# Altium project Pixhack_V5_CORE_V16.PrjPcb
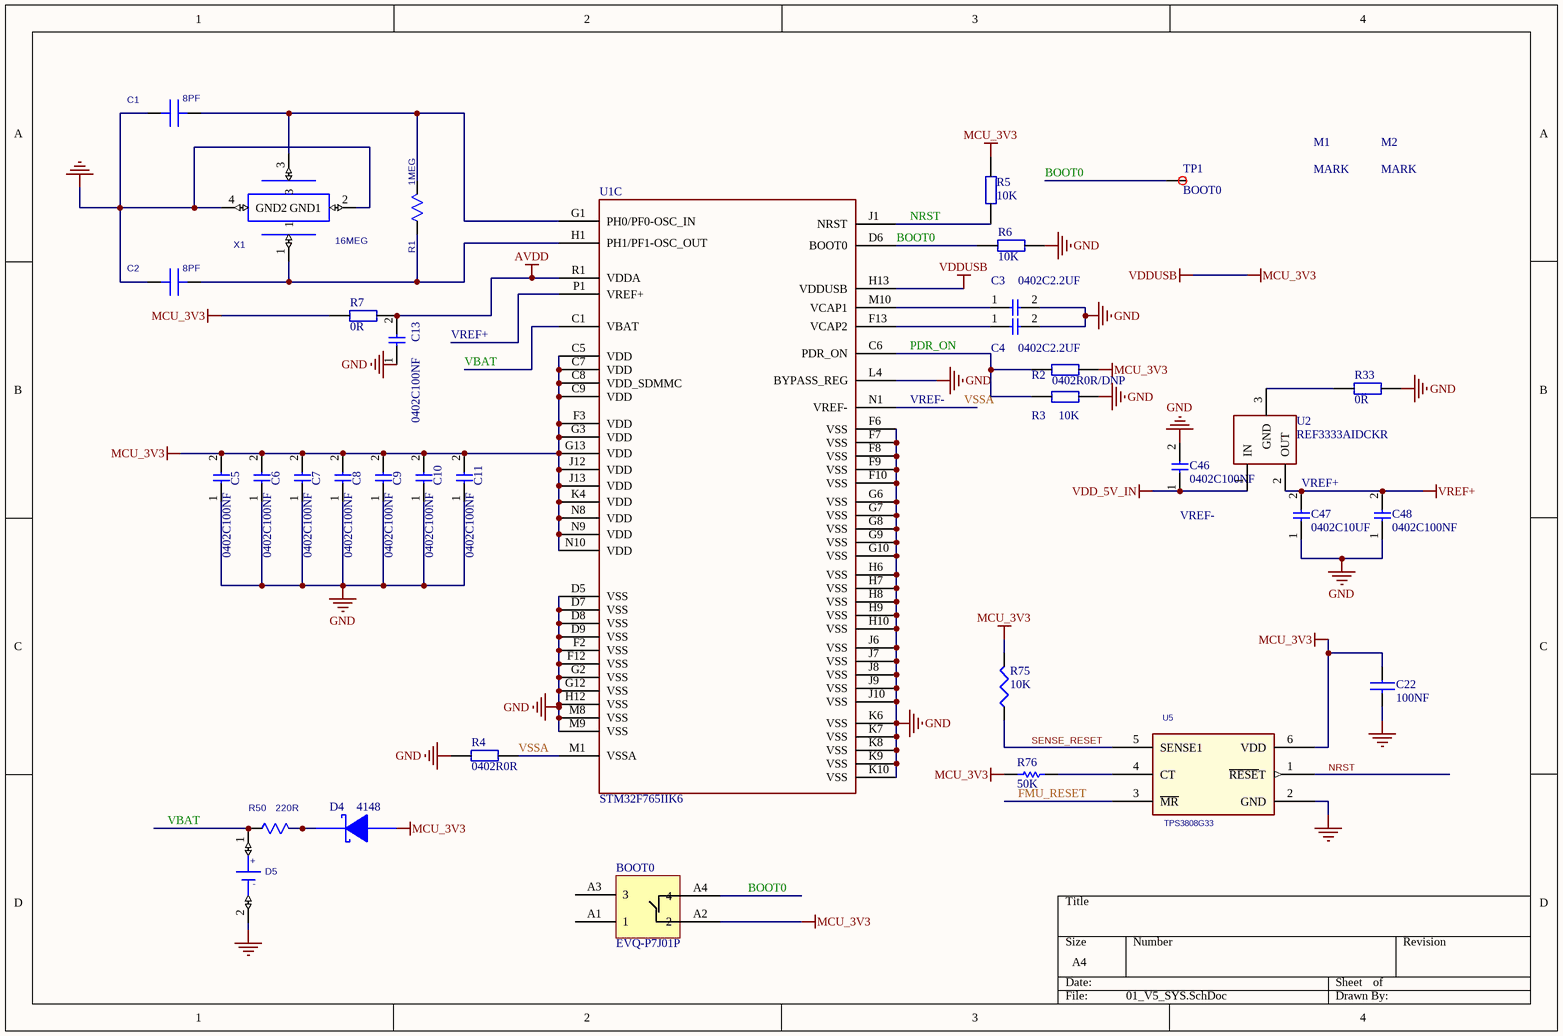
[diagram p0: 01_V5_SYS.SchDoc]
6 sheets, 100 parts. Net scope: global (net labels, ports and power ports of the same name join across sheets).
Board file: V5_CORE_V1.6.PcbDoc
Sheets:
  01_V5_SYS.SchDoc
  02_V5_IO1.SchDoc
  10_CAN_BUS.SchDoc
  IMU_CON.SchDoc
  11_5V_RAIL_ADC.SchDoc
  12_B_TO_B.SchDoc

## Sheet 01_V5_SYS.SchDoc
size A4

### Parts
BOOT0  EVQ-P7J01P  [EVQ-P7J01P]
C1  8PF  [SC0402]
C2  8PF  [SC0402]
C3  0402C2.2UF  [0402C]
C4  0402C2.2UF  [0402C]
C5  0402C100NF  [0402C]
C6  0402C100NF  [0402C]
C7  0402C100NF  [0402C]
C8  0402C100NF  [0402C]
C9  0402C100NF  [0402C]
C10  0402C100NF  [0402C]
C11  0402C100NF  [0402C]
C13  0402C100NF  [0402C]
C22  100NF  [0402cap]
C46  0402C100NF  [0402C]
C47  0402C10UF  [0402C]
C48  0402C100NF  [0402C]
D4  4148  [SOD323]
D5  PAS414HR-VE5R  [PAS414R-S-VE5R]  (value not drawn)
M1  MARK  [MARK]
M2  MARK  [MARK]
R1  1MEG  [SR0402]
R2  0402R0R/DNP  [0402R]
R3  10K  [0402R]
R4  0402R0R  [0402R]
R5  10K  [0402R]
R6  10K  [0402R]
R7  0R  [0402R]
R33  0R  [0402R]
R50  220R  [0402r]
R75  10K  [R0402]
R76  50K  [0402R]
TP1  BOOT0  [TP0.75]
U1  STM32F765IIK6  [UFBGA176]  (part C of 3)
U2  REF3333AIDCKR  [SC70]
U5  TPS3808G33  [SOT-23-6]
X1  16MEG  [3225]

### Nets
AVDD: C13.2 R7.1 U1.R1(VDDA)
GND: C1.1(A) C2.1(A) C3.2 C4.2 C5.1 C6.1 C7.1 C8.1 C9.1 C10.1 C11.1 C13.1 C22.2 C46.2 C47.1 C48.1 D5.2(-) R3.2 R4.1 R6.1 R33.1 U1.D5(VSS) U1.D7(VSS) U1.D8(VSS) U1.D9(VSS) U1.F2(VSS) U1.F6(VSS) U1.F7(VSS) U1.F8(VSS) U1.F9(VSS) U1.F10(VSS) U1.F12(VSS) U1.G2(VSS) U1.G6(VSS) U1.G7(VSS) U1.G8(VSS) U1.G9(VSS) U1.G10(VSS) U1.G12(VSS) U1.H6(VSS) U1.H7(VSS) U1.H8(VSS) U1.H9(VSS) U1.H10(VSS) U1.H12(VSS) U1.J6(VSS) U1.J7(VSS) U1.J8(VSS) U1.J9(VSS) U1.J10(VSS) U1.K6(VSS) U1.K7(VSS) U1.K8(VSS) U1.K9(VSS) U1.K10(VSS) U1.L4(BYPASS_REG) U1.M8(VSS) U1.M9(VSS) U5.2(GND) X1.2(GND1) X1.4(GND2)
MCU_3V3: BOOT0.A2(2) C5.2 C6.2 C7.2 C8.2 C9.2 C10.2 C11.2 C22.1 D4.A R2.2 R5.2 R7.2 R75.2 R76.2 U1.C5(VDD) U1.C7(VDD) U1.C8(VDD_SDMMC) U1.C9(VDD) U1.F3(VDD) U1.G3(VDD) U1.G13(VDD) U1.H13(VDDUSB) U1.J12(VDD) U1.J13(VDD) U1.K4(VDD) U1.N8(VDD) U1.N9(VDD) U1.N10(VDD) U5.6(VDD)  [also labelled VDDUSB]
VDD_5V_IN: C46.1 U2.1(IN)
VREF+: C47.2 C48.2 U1.P1(VREF+) U2.2(OUT)
BOOT0: BOOT0.A4(4) R6.2 TP1.0 U1.D6(BOOT0)
FMU_RESET: U5.3(~{MR})
NRST: R5.1 U1.J1(NRST) U5.1(~{RESE}T)
PDR_ON: R2.1 R3.1 U1.C6(PDR_ON)
SENSE_RESET: R75.1 U5.5(SENSE1)
VBAT: D5.1(+) R50.1(A) U1.C1(VBAT)
VREF-: R4.2 U1.M1(VSSA) U1.N1(VREF-)  [also labelled VSSA]
NetC1_2: C1.2(B) R1.2(B) U1.G1(PH0/PF0-OSC_IN) X1.3
NetC2_2: C2.2(B) R1.1(A) U1.H1(PH1/PF1-OSC_OUT) X1.1
NetC3_1: C3.1 U1.M10(VCAP1)
NetC4_1: C4.1 U1.F13(VCAP2)
NetD4_K: D4.K R50.2(B)
NetR33_2: R33.2 U2.3(GND)
NetR76_1: R76.1 U5.4(CT)

Not connected (* = marked no-connect by the designer): BOOT0 A1(1) A3(3)

### Notes on the sheet
- (near D5) +
- (near D5) -
- Labels drawn without touching a wire or pin: VREF-

### Library data of the parts
C1 C2 = C
C5-C11 C13 = 0402C100NF: 50V 5%
C22 = C1005X5R1H104K
C46-C48 = 0402C2.2UF
D4 = STPS20M100SG-TR: Manufacturer Name: STMicroelectronics; PackageReference: STPS20M100SG-TR; Manufacturer Part Number: STPS20M100SG-TR; Value: 4148
D5 = PWR1-2_1
R1 = R
R2-R7 R33 = 0402R0R: 0402R0R 1%
R50 = R: PARTS: 1; OriginalSymbolOrigin: (10,20); PINSWAP: (A,B); DEVICE: RK73H1ETTP1004F; PKG_TYPE: SR0402; LEVEL: STD; %208%%161%%192%%224%%195%%251%%179%%198%: 片式厚膜电阻器; COMPONENT_HIGH_MAX: 0.4MM; %215%%232%%214%%181%%212%%202%%208%%237%%198%%171%%178%%238%: +/-1%; %182%%238%%182%%168%%185%%166%%194%%202%(W): 0.06; %195%%232%%202%%246%: 片式厚膜电阻器-0.0625W-1000000OHM-+/-1%-0402; CODE: 7090857
R75 = RMCF0402FT4K99
R76 = Res Semi: Semiconductor Resistor
TP1 = TP_0.75: TP_0.75MM
U2 = REF3333AIDCKT
U5 = TPS3808G09DBVR: IC VOLT SUPERVISOR 0.9V SOT23-6; Part #: 102020-0009R; Manufacturer: Texas Instruments; .Checked PCB: used; Number of Voltages Monitored: 1; Output: Open Drain or Open Collector; Reset: Active Low; Reset Timeout: Adjustable/Selectable; Voltage - Threshold: 0.84V; .Checked SCH: used; Category: Integrated Circuits (ICs); Supplier Part Number: 296-17189-1-ND; Family: PMIC - Supervisors; Manufacturer Part Number: TPS3808G09DBVR; Operating Temperature: -40癈 ~ 125癈; Package / Case: SOT-23-6; Price 1k [$]: 1.12000; Value: TPS3808G09DBVR; Type: Simple Reset/Power-On Reset; Supplier: Digikey; Supplier 1: Digi-Key; Supplier Part Number 1: 296-17189-1-ND; RoHS: RoHS Compliant; Stock 1: 61681; Pricing 1: 1=2.45, 25=1.89, 100=1.715, 250=1.54, 500=1.33, 1000=1.12 (USD); Mounting Type: Surface Mount; Supplier Device Package: SOT-23-6; Packaging: Cut Tape (CT); ComponentLink1URL: http://www.ti.com/lit/ds/symlink/tps3808g01.pdf; ComponentLink1Description: http://www.ti.com/lit/ds/symlink/tps3808g01.pdf
X1 = X_B

## Sheet 02_V5_IO1.SchDoc
size A4
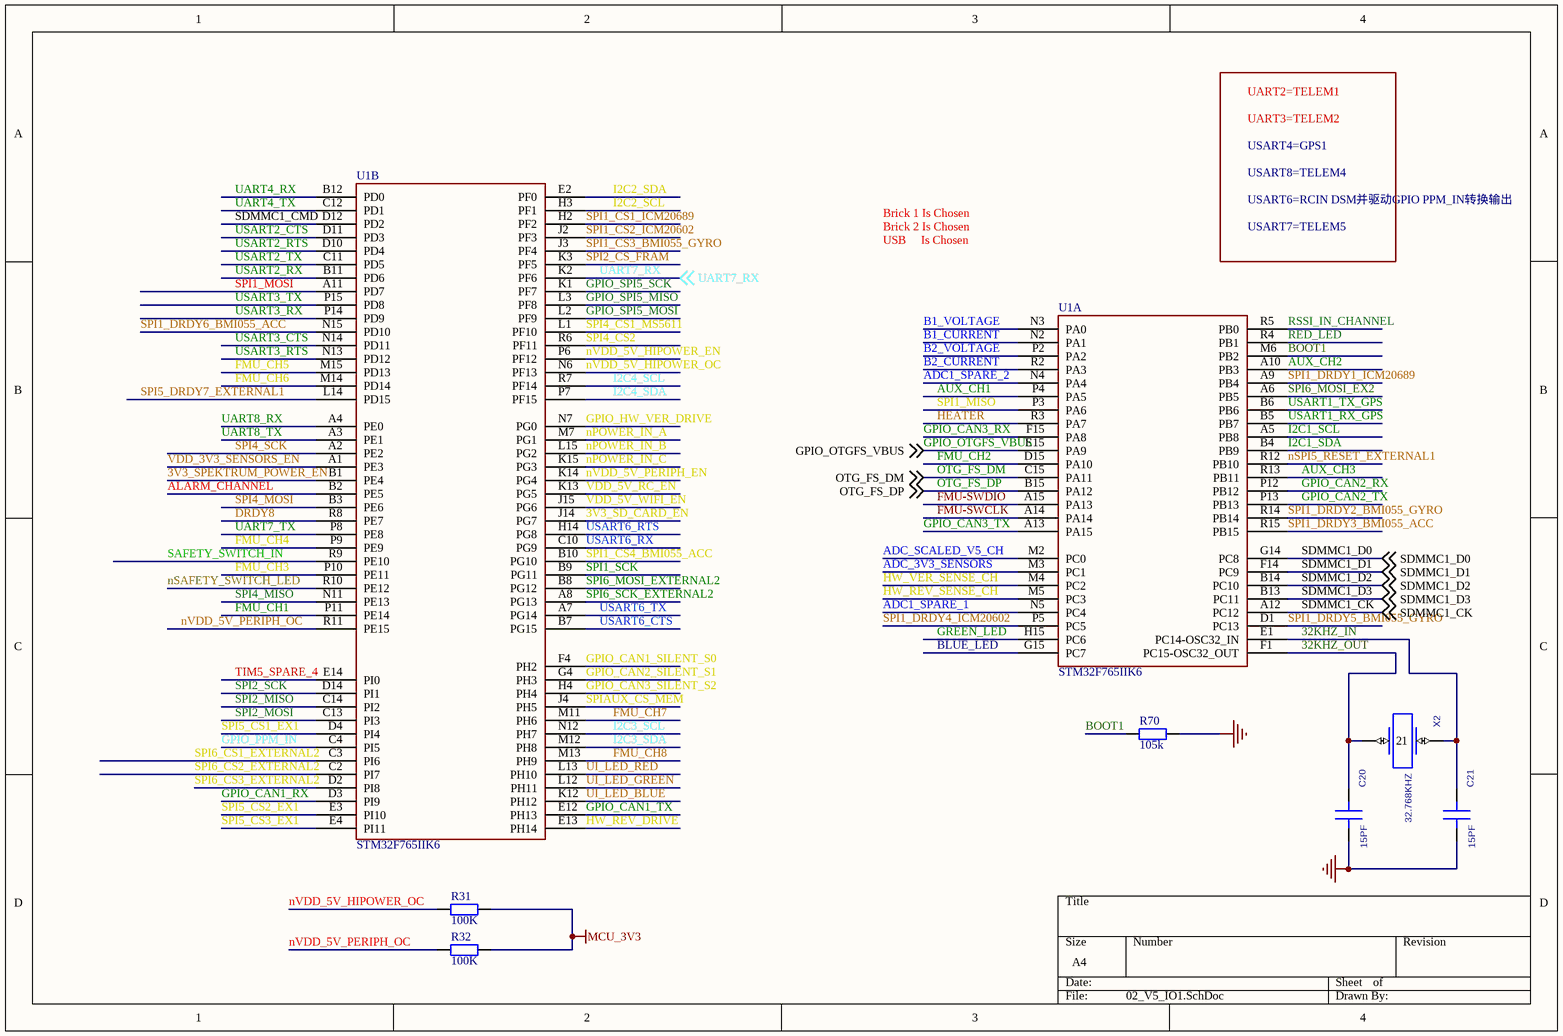
[diagram p1: 02_V5_IO1.SchDoc]

### Parts
C20  15PF  [SC0402]
C21  15PF  [SC0402]
R31  100K  [R0402]
R32  100K  [R0402]
R70  105k  [R0402]
U1  STM32F765IIK6  [UFBGA176]  (parts A,B of 3)
X2  32.768KHZ  [ABS06]

### Nets
GND: C20.2(B) C21.2(B) R70.2
GPIO_HW_VER_DRIVE: U1.N7(PG0)
HW_REV_DRIVE: U1.E13(PH14)
MCU_3V3: R31.2 R32.2
3V3_SD_CARD_EN: U1.J14(PG7)
3V3_SPEKTRUM_POWER_EN: U1.B1(PE4)
32KHZ_IN: C21.1(A) U1.E1(PC14-OSC32_IN) X2.1
32KHZ_OUT: C20.1(A) U1.F1(PC15-OSC32_OUT) X2.2
ADC1_SPARE_1: U1.N5(PC4)
ADC1_SPARE_2: U1.N4(PA4)
ADC_3V3_SENSORS: U1.M3(PC1)
ADC_SCALED_V5_CH: U1.M2(PC0)
ALARM_CHANNEL: U1.B2(PE5)
AUX_CH1: U1.P4(PA5)
AUX_CH2: U1.A10(PB3)
AUX_CH3: U1.R13(PB11)
B1_CURRENT: U1.N2(PA1)
B1_VOLTAGE: U1.N3(PA0)
B2_CURRENT: U1.R2(PA3)  [project net AUX_BATT_CURRENT_SENS]
B2_VOLTAGE: U1.P2(PA2)  [project net AUX_BATT_VOLTAGE_SENS]
BLUE_LED: U1.G15(PC7)
BOOT1: R70.1 U1.M6(PB2)
DRDY8: U1.R8(PE7)
FMU-SWCLK: U1.A14(PA14)
FMU-SWDIO: U1.A15(PA13)
FMU_CH1: U1.P11(PE14)
FMU_CH2: U1.D15(PA10)
FMU_CH3: U1.P10(PE11)
FMU_CH4: U1.P9(PE9)
FMU_CH5: U1.M15(PD13)
FMU_CH6: U1.M14(PD14)
FMU_CH7: U1.M11(PH6)
FMU_CH8: U1.M13(PH9)
GPIO_CAN1_RX: U1.D3(PI9)
GPIO_CAN1_SILENT_S0: U1.F4(PH2)
GPIO_CAN1_TX: U1.E12(PH13)
GPIO_CAN2_RX: U1.P12(PB12)
GPIO_CAN2_SILENT_S1: U1.G4(PH3)
GPIO_CAN2_TX: U1.P13(PB13)
GPIO_CAN3_RX: U1.F15(PA8)
GPIO_CAN3_SILENT_S2: U1.H4(PH4)
GPIO_CAN3_TX: U1.A13(PA15)
GPIO_OTGFS_VBUS: U1.E15(PA9) ; off-sheet GPIO_OTGFS_VBUS
GPIO_PPM_IN: U1.C4(PI5)
GPIO_SPI5_MISO: U1.L3(PF8)
GPIO_SPI5_MOSI: U1.L2(PF9)
GPIO_SPI5_SCK: U1.K1(PF7)
GREEN_LED: U1.H15(PC6)
HEATER: U1.R3(PA7)
HW_REV_SENSE_CH: U1.M5(PC3)
HW_VER_SENSE_CH: U1.M4(PC2)
I2C1_SCL: U1.A5(PB8)
I2C1_SDA: U1.B4(PB9)
I2C2_SCL: U1.H3(PF1)
I2C2_SDA: U1.E2(PF0)
I2C3_SCL: U1.N12(PH7)
I2C3_SDA: U1.M12(PH8)
I2C4_SCL: U1.R7(PF14)
I2C4_SDA: U1.P7(PF15)
nPOWER_IN_A: U1.M7(PG1)
nPOWER_IN_B: U1.L15(PG2)
nPOWER_IN_C: U1.K15(PG3)
nSAFETY_SWITCH_LED: U1.R10(PE12)
nSPI5_RESET_EXTERNAL1: U1.R12(PB10)
nVDD_5V_HIPOWER_EN: U1.P6(PF12)
nVDD_5V_HIPOWER_OC: R31.1 U1.N6(PF13)
nVDD_5V_PERIPH_EN: U1.K14(PG4)
nVDD_5V_PERIPH_OC: R32.1 U1.R11(PE15)
OTG_FS_DM: U1.C15(PA11) ; off-sheet OTG_FS_DM
OTG_FS_DP: U1.B15(PA12) ; off-sheet OTG_FS_DP
RED_LED: U1.R4(PB1)
RSSI_IN_CHANNEL: U1.R5(PB0)
SAFETY_SWITCH_IN: U1.R9(PE10)
SDMMC1_CK: U1.A12(PC12) ; off-sheet SDMMC1_CK
SDMMC1_CMD: U1.D12(PD2)
SDMMC1_D0: U1.G14(PC8) ; off-sheet SDMMC1_D0
SDMMC1_D1: U1.F14(PC9) ; off-sheet SDMMC1_D1
SDMMC1_D2: U1.B14(PC10) ; off-sheet SDMMC1_D2
SDMMC1_D3: U1.B13(PC11) ; off-sheet SDMMC1_D3
SPI1_CS1_ICM20689: U1.H2(PF2)
SPI1_CS2_ICM20602: U1.J2(PF3)
SPI1_CS3_BMI055_GYRO: U1.J3(PF4)
SPI1_CS4_BMI055_ACC: U1.B10(PG10)
SPI1_DRDY1_ICM20689: U1.A9(PB4)
SPI1_DRDY2_BMI055_GYRO: U1.R14(PB14)
SPI1_DRDY3_BMI055_ACC: U1.R15(PB15)
SPI1_DRDY4_ICM20602: U1.P5(PC5)
SPI1_DRDY5_BMI055_GYRO: U1.D1(PC13)
SPI1_DRDY6_BMI055_ACC: U1.N15(PD10)
SPI1_MISO: U1.P3(PA6)
SPI1_MOSI: U1.A11(PD7)
SPI1_SCK: U1.B9(PG11)
SPI2_CS_FRAM: U1.K3(PF5)
SPI2_MISO: U1.C14(PI2)
SPI2_MOSI: U1.C13(PI3)
SPI2_SCK: U1.D14(PI1)
SPI4_CS1_MS5611: U1.L1(PF10)
SPI4_CS2: U1.R6(PF11)
SPI4_MISO: U1.N11(PE13)
SPI4_MOSI: U1.B3(PE6)
SPI4_SCK: U1.A2(PE2)
SPI5_CS1_EX1: U1.D4(PI4)
SPI5_CS2_EX1: U1.E3(PI10)
SPI5_CS3_EX1: U1.E4(PI11)
SPI5_DRDY7_EXTERNAL1: U1.L14(PD15)
SPI6_CS1_EXTERNAL2: U1.C3(PI6)
SPI6_CS2_EXTERNAL2: U1.C2(PI7)
SPI6_CS3_EXTERNAL2: U1.D2(PI8)
SPI6_MOSI_EX2: U1.A6(PB5)
SPI6_MOSI_EXTERNAL2: U1.B8(PG12)
SPI6_SCK_EXTERNAL2: U1.A8(PG13)
SPIAUX_CS_MEM: U1.J4(PH5)
TIM5_SPARE_4: U1.E14(PI0)
UART4_RX: U1.B12(PD0)
UART4_TX: U1.C12(PD1)
UART7_RX: U1.K2(PF6) ; off-sheet UART7_RX
UART7_TX: U1.P8(PE8)
UART8_RX: U1.A4(PE0)
UART8_TX: U1.A3(PE1)
UI_LED_BLUE: U1.K12(PH12)
UI_LED_GREEN: U1.L12(PH11)
UI_LED_RED: U1.L13(PH10)
USART1_RX_GPS: U1.B5(PB7)
USART1_TX_GPS: U1.B6(PB6)
USART2_CTS: U1.D11(PD3)
USART2_RTS: U1.D10(PD4)
USART2_RX: U1.B11(PD6)
USART2_TX: U1.C11(PD5)
USART3_CTS: U1.N14(PD11)
USART3_RTS: U1.N13(PD12)
USART3_RX: U1.P14(PD9)
USART3_TX: U1.P15(PD8)
USART6_CTS: U1.B7(PG15)
USART6_RTS: U1.H14(PG8)
USART6_RX: U1.C10(PG9)
USART6_TX: U1.A7(PG14)
VDD_3V3_SENSORS_EN: U1.A1(PE3)
VDD_5V_RC_EN: U1.K13(PG5)
VDD_5V_WIFI_EN: U1.J15(PG6)

### Notes on the sheet
- Labels drawn without touching a wire or pin: Brick 1 Is Chosen, Brick 2 Is Chosen, UART2=TELEM1, UART3=TELEM2, USART4=GPS1, USART6=RCIN DSM并驱动GPIO PPM_IN转换输出, USART7=TELEM5, USART8=TELEM4, USB     Is Chosen

### Library data of the parts
C20 = C: PARTS: 1; OriginalSymbolOrigin: (0,30); DEVICE: C0402C150J5GAC_7867; LEVEL: STD; PINSWAP: (A,B); %208%%161%%192%%224%%195%%251%%179%%198%: SMD陶瓷电容; COMPONENT_HIGH_MAX: 0.55MM; %182%%238%%182%%168%%185%%164%%215%%247%%181%%231%%209%%185%(V): 50; %195%%232%%202%%246%: SMD陶瓷电容-50V-0.015NF-+/-5%-NP0-0402; CODE: 8070544; PKG_TYPE: SC0402
C21 = C: PARTS: 1; OriginalSymbolOrigin: (0,30); DEVICE: C0402C150J5GAC_7867; LEVEL: STD; PINSWAP: (A,B); CODE: 8070544; %195%%232%%202%%246%: SMD陶瓷电容-50V-0.015NF-+/-5%-NP0-0402; %182%%238%%182%%168%%185%%164%%215%%247%%181%%231%%209%%185%(V): 50; COMPONENT_HIGH_MAX: 0.55MM; %208%%161%%192%%224%%195%%251%%179%%198%: SMD陶瓷电容; PKG_TYPE: SC0402
R31 R32 R70 = Res2: Resistor; Value: 1K; Published: 8-Jun-2000; LatestRevisionDate: 17-Jul-2002; LatestRevisionNote: Re-released for DXP Platform.; PackageReference: AXIAL-0.4; Publisher: Altium Limited; PackageDescription: Axial Device, Thru-Hole; 2 Leads; 0.4 in Pin Spacing
X2 = X_0: PARTS: 1; OriginalSymbolOrigin: (10,40); LEVEL: STD; PKG_TYPE: HSX2-0302; DEVICE: 9H03200019; CODE: 12020212; %208%%161%%192%%224%%195%%251%%179%%198%: 晶体谐振器; COMPONENT_HIGH_MAX: 0.85MM; %195%%232%%202%%246%: 晶体谐振器-0.032768MHZ-12.5PF-+/-20PPM-70000OHM-SMD3.2*1.5

## Sheet 10_CAN_BUS.SchDoc
size A4
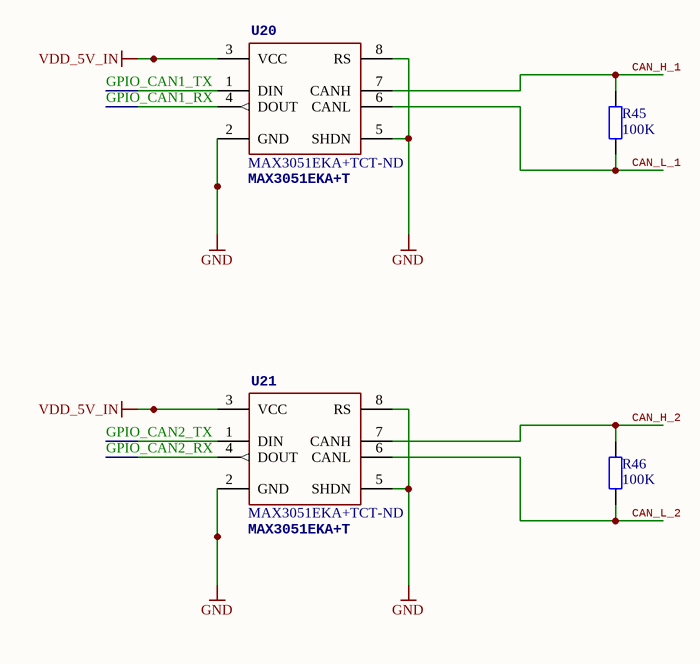
[diagram p2: 10_CAN_BUS.SchDoc]

### Parts
R45  100K  [R0402]
R46  100K  [R0402]
U20  MAX3051EKA+T  Supplier Part Number 1: MAX3051EKA+TCT-ND  [SOT23-8]
U21  MAX3051EKA+T  Supplier Part Number 1: MAX3051EKA+TCT-ND  [SOT23-8]

### Nets
GND: U20.2(GND) U20.5(SHDN) U20.8(RS) U21.2(GND) U21.5(SHDN) U21.8(RS)
VDD_5V_IN: U20.3(VCC) U21.3(VCC)
CAN_H_1: R45.1 U20.7(CANH)
CAN_H_2: R46.1 U21.7(CANH)
CAN_L_1: R45.2 U20.6(CANL)
CAN_L_2: R46.2 U21.6(CANL)
GPIO_CAN1_RX: U20.4(DOUT)
GPIO_CAN1_TX: U20.1(DIN)
GPIO_CAN2_RX: U21.4(DOUT)
GPIO_CAN2_TX: U21.1(DIN)

### Library data of the parts
R45 R46 = Res2: Resistor; Value: 1K; Published: 8-Jun-2000; LatestRevisionDate: 17-Jul-2002; LatestRevisionNote: Re-released for DXP Platform.; PackageReference: AXIAL-0.4; Publisher: Altium Limited; PackageDescription: Axial Device, Thru-Hole; 2 Leads; 0.4 in Pin Spacing
U20 U21 = MAX3051MAX3051EKA: IC TXRX CAN 1MBPS SOT23-8; 3DR_PARTNO: ECM0831; Supplier 1: Digi-Key; PARTNO: MAX3051EKA+T; Value: CAN

## Sheet IMU_CON.SchDoc
size A4
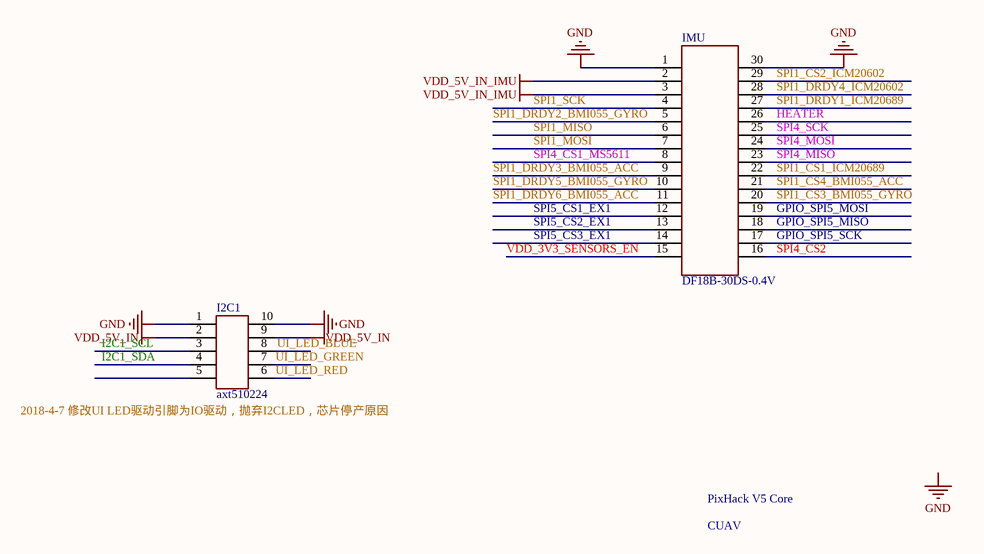
[diagram p3: IMU_CON.SchDoc]

### Parts
I2C1  axt510224  [axt510224]
IMU  DF18B-30DS-0.4V  [DF18B-30DS-0.4V]
PixHack_V5_Core  CUAV  [CUAV]

### Nets
GND: I2C1.1 I2C1.10 IMU.1 IMU.30
VDD_5V_IN: I2C1.2 I2C1.9
VDD_5V_IN_IMU: IMU.2 IMU.3
GPIO_SPI5_MISO: IMU.18
GPIO_SPI5_MOSI: IMU.19
GPIO_SPI5_SCK: IMU.17
HEATER: IMU.26
I2C1_SCL: I2C1.3
I2C1_SDA: I2C1.4
SPI1_CS1_ICM20689: IMU.22
SPI1_CS2_ICM20602: IMU.29
SPI1_CS3_BMI055_GYRO: IMU.20
SPI1_CS4_BMI055_ACC: IMU.21
SPI1_DRDY1_ICM20689: IMU.27
SPI1_DRDY2_BMI055_GYRO: IMU.5
SPI1_DRDY3_BMI055_ACC: IMU.9
SPI1_DRDY4_ICM20602: IMU.28
SPI1_DRDY5_BMI055_GYRO: IMU.10
SPI1_DRDY6_BMI055_ACC: IMU.11
SPI1_MISO: IMU.6
SPI1_MOSI: IMU.7
SPI1_SCK: IMU.4
SPI4_CS1_MS5611: IMU.8
SPI4_CS2: IMU.16
SPI4_MISO: IMU.23
SPI4_MOSI: IMU.24
SPI4_SCK: IMU.25
SPI5_CS1_EX1: IMU.12
SPI5_CS2_EX1: IMU.13
SPI5_CS3_EX1: IMU.14
UI_LED_BLUE: I2C1.8
UI_LED_GREEN: I2C1.7
UI_LED_RED: I2C1.6
VDD_3V3_SENSORS_EN: IMU.15

Not connected (* = marked no-connect by the designer): I2C1 5

### Notes on the sheet
- Labels drawn without touching a wire or pin: 2018-4-7 修改UI LED驱动引脚为IO驱动，抛弃I2CLED，芯片停产原因, GND

## Sheet 11_5V_RAIL_ADC.SchDoc
size A4
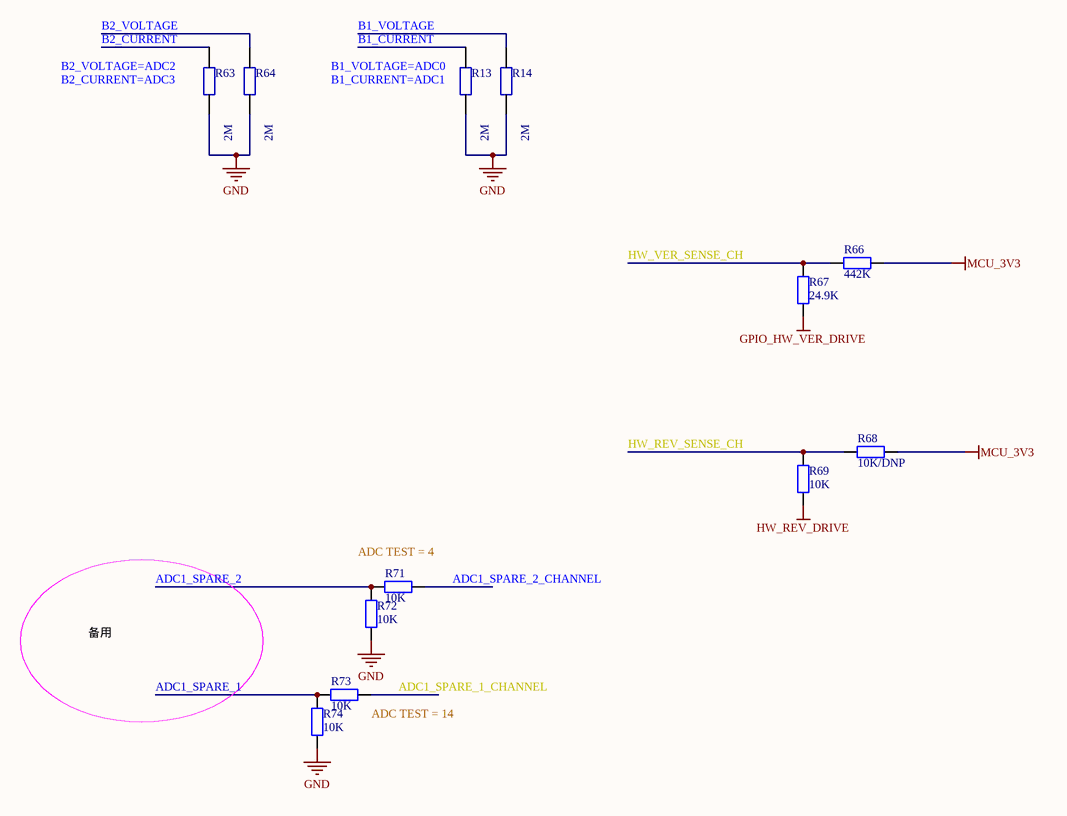
[diagram p4: 11_5V_RAIL_ADC.SchDoc]

### Parts
R13  2M  [0402R]
R14  2M  [0402R]
R63  2M  [0402R]
R64  2M  [0402R]
R66  442K  [R0402]
R67  24.9K  [R0402]
R68  10K/DNP  [R0402]
R69  10K  [R0402]
R71  10K  [R0402]
R72  10K  [R0402]
R73  10K  [R0402]
R74  10K  [R0402]

### Nets
GND: R13.2 R14.2 R63.2 R64.2 R72.1 R74.1
GPIO_HW_VER_DRIVE: R67.1
HW_REV_DRIVE: R69.1
MCU_3V3: R66.2 R68.2
ADC1_SPARE_1: R73.1 R74.2
ADC1_SPARE_1_CHANNEL: R73.2
ADC1_SPARE_2: R71.1 R72.2
ADC1_SPARE_2_CHANNEL: R71.2
B1_CURRENT: R13.1
B1_VOLTAGE: R14.1
B2_CURRENT: R63.1  [project net AUX_BATT_CURRENT_SENS]
B2_VOLTAGE: R64.1  [project net AUX_BATT_VOLTAGE_SENS]
HW_REV_SENSE_CH: R68.1 R69.2
HW_VER_SENSE_CH: R66.1 R67.2

### Notes on the sheet
- Labels drawn without touching a wire or pin: ADC TEST = 4, ADC TEST = 14, B1_CURRENT=ADC1, B1_VOLTAGE=ADC0, B2_CURRENT=ADC3, B2_VOLTAGE=ADC2, 备用

### Library data of the parts
R13 R14 R63 R64 = 0402R10K: 0402R10K 1%
R66-R69 R71-R74 = Res2: Resistor; Value: 1K; Published: 8-Jun-2000; LatestRevisionDate: 17-Jul-2002; LatestRevisionNote: Re-released for DXP Platform.; PackageReference: AXIAL-0.4; Publisher: Altium Limited; PackageDescription: Axial Device, Thru-Hole; 2 Leads; 0.4 in Pin Spacing

## Sheet 12_B_TO_B.SchDoc
size A3
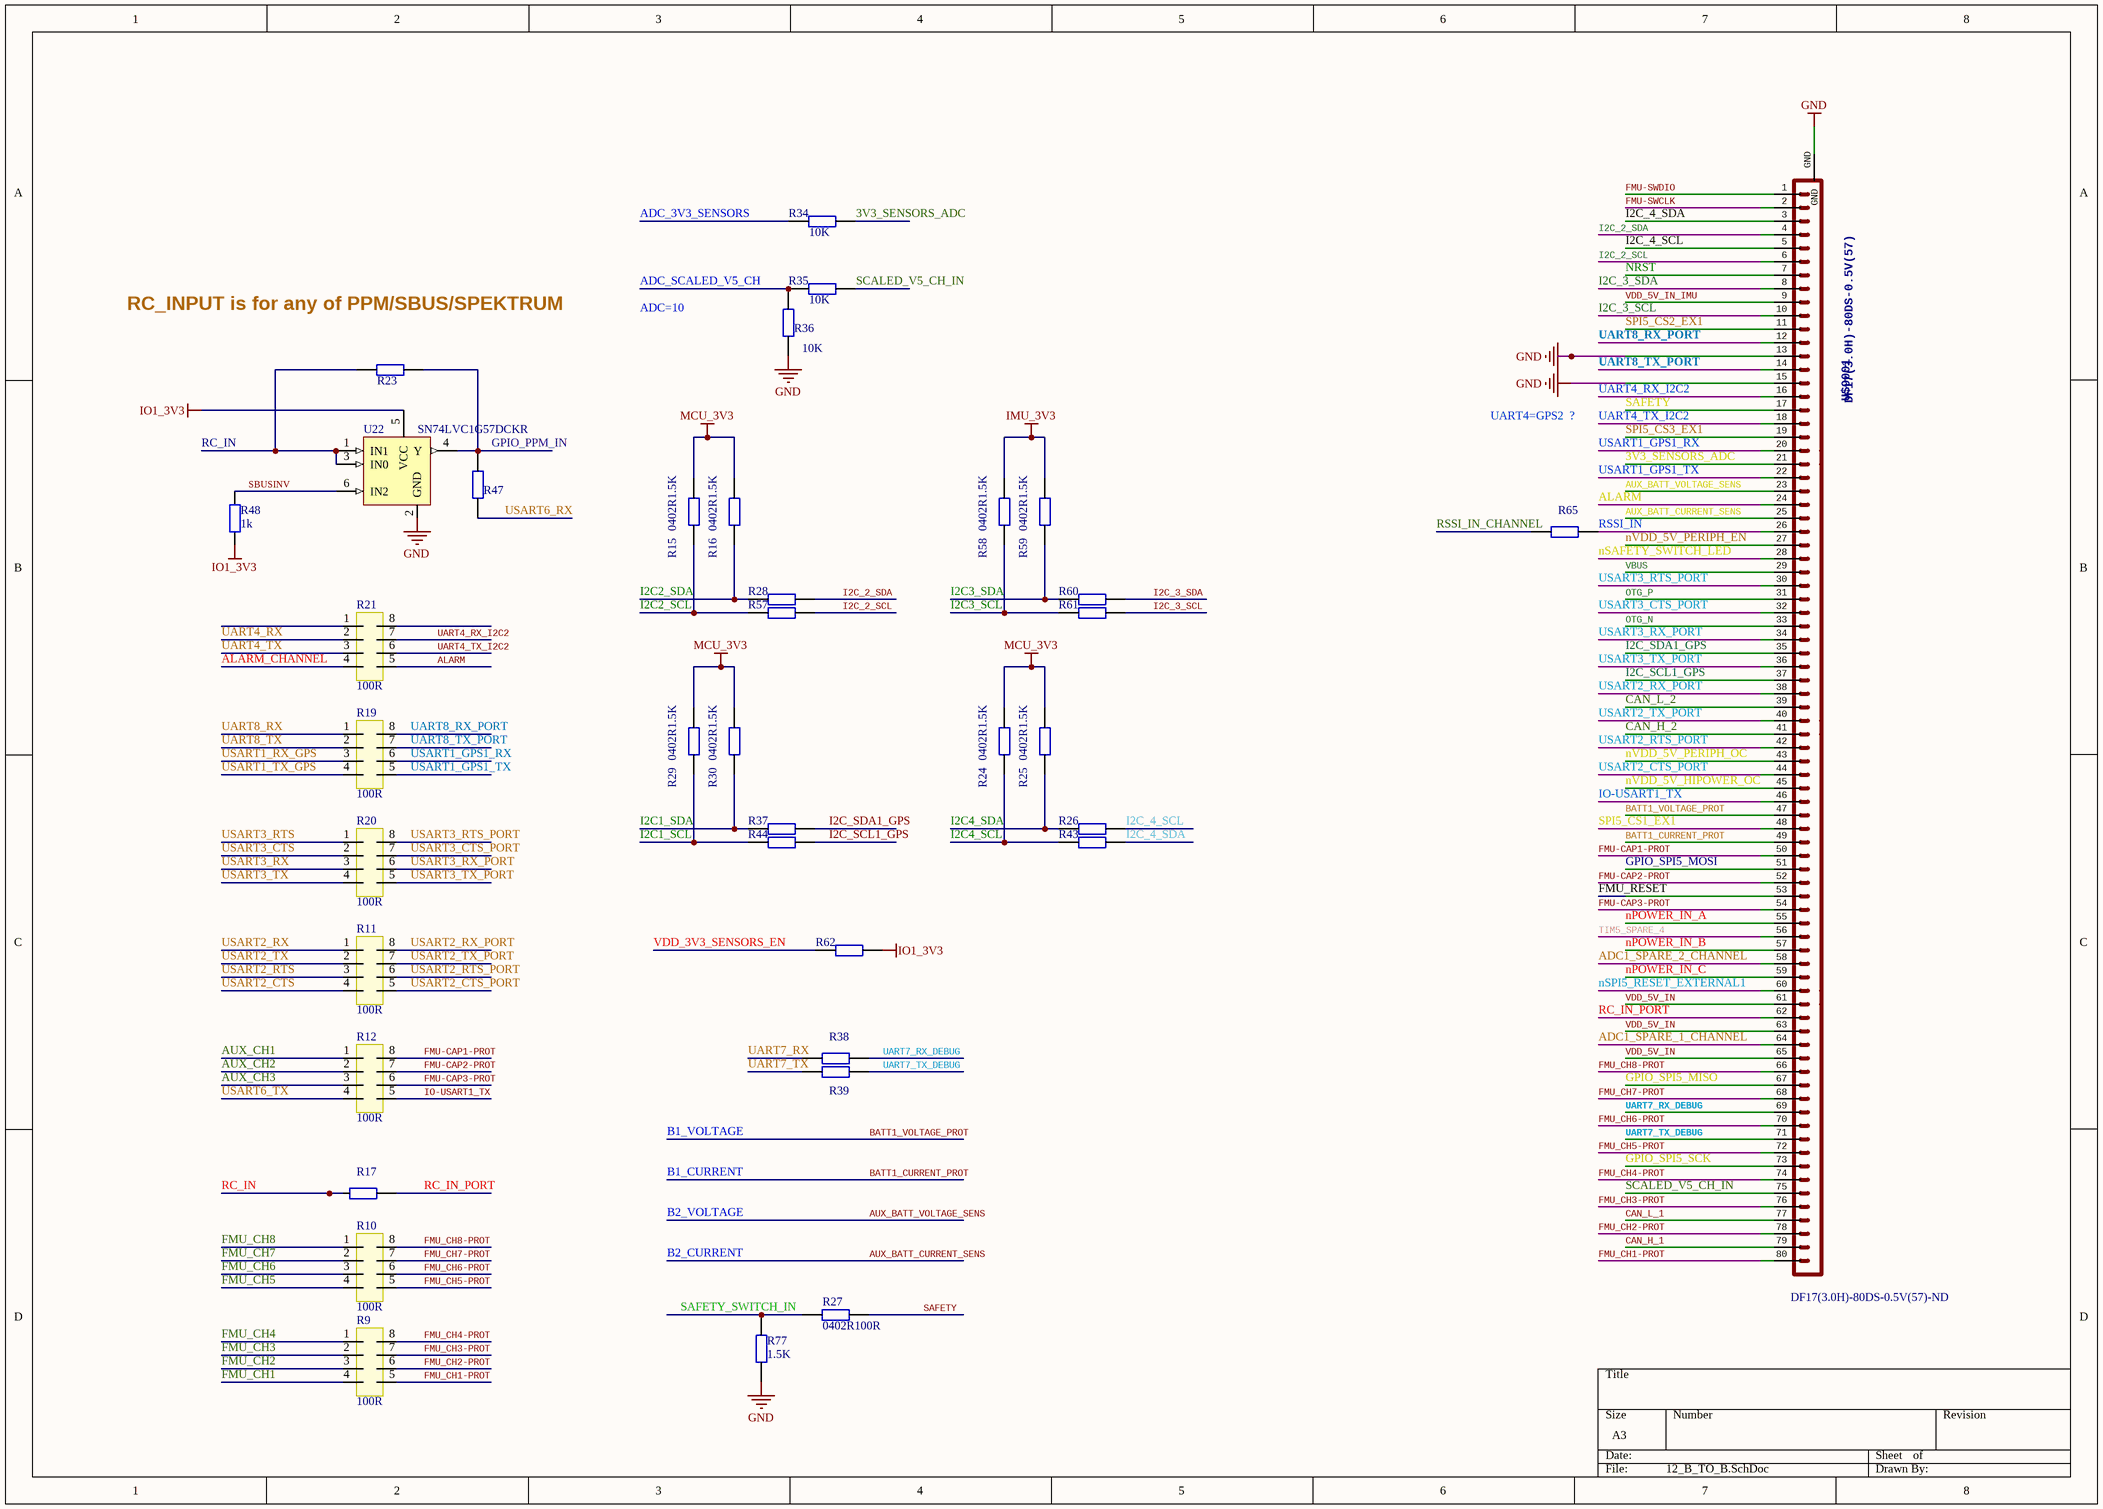
[diagram p5: 12_B_TO_B.SchDoc]

### Parts
R9  100R  [0402_4r]
R10  100R  [0402_4r]
R11  100R  [0402_4r]
R12  100R  [0402_4r]
R15  0402R1.5K  [0402R]
R16  0402R1.5K  [0402R]
R17  0402R100R  [0402R]  (value not drawn)
R19  100R  [0402_4r]
R20  100R  [0402_4r]
R21  100R  [0402_4r]
R23  100R/NC  [0402R]  (value not drawn)
R24  0402R1.5K  [0402R]
R25  0402R1.5K  [0402R]
R26  0402R100R  [0402R]  (value not drawn)
R27  0402R100R  [0402R]
R28  0402R100R  [0402R]  (value not drawn)
R29  0402R1.5K  [0402R]
R30  0402R1.5K  [0402R]
R34  10K  [0402R]
R35  10K  [0402R]
R36  10K  [0402R]
R37  0402R100R  [0402R]  (value not drawn)
R38  0402R100R  [0402R]  (value not drawn)
R39  0402R100R  [0402R]  (value not drawn)
R43  0402R100R  [0402R]  (value not drawn)
R44  0402R100R  [0402R]  (value not drawn)
R47  100R  [0402R]  (value not drawn)
R48  1k  [R0402]
R57  0402R100R  [0402R]  (value not drawn)
R58  0402R1.5K  [0402R]
R59  0402R1.5K  [0402R]
R60  0402R100R  [0402R]  (value not drawn)
R61  0402R100R  [0402R]  (value not drawn)
R62  10K/NC  [0402R]  (value not drawn)
R65  0402R100R  [0402R]  (value not drawn)
R77  1.5K  [0402R]
U22  SN74LVC1G57DCKR  [sot323-6]
U$9001  DF17(3.0H)-80DS-0.5V(57)  Supplier Part Number 1: DF17(3.0H)-80DS-0.5V(57)-ND  [DF17(3.0H)-80DS-0.5V(57)]

### Nets
GND: R36.1 R77.1 U22.2(GND) U$9001.13 U$9001.15 U$9001.GND
IMU_3V3: R58.2 R59.2
IO1_3V3: R48.1 R62.2 U22.5(VCC)
MCU_3V3: R15.2 R16.2 R24.2 R25.2 R29.2 R30.2
VDD_5V_IN: U$9001.61 U$9001.63 U$9001.65
VDD_5V_IN_IMU: U$9001.9
3V3_SENSORS_ADC: R34.2 U$9001.21
ADC1_SPARE_1_CHANNEL: U$9001.64
ADC1_SPARE_2_CHANNEL: U$9001.58
ADC_3V3_SENSORS: R34.1
ADC_SCALED_V5_CH: R35.1 R36.2
ALARM: R21.5 U$9001.24
ALARM_CHANNEL: R21.4
AUX_BATT_CURRENT_SENS: U$9001.25  [also labelled B2_CURRENT]
AUX_BATT_VOLTAGE_SENS: U$9001.23  [also labelled B2_VOLTAGE]
AUX_CH1: R12.1
AUX_CH2: R12.2
AUX_CH3: R12.3
B1_CURRENT: U$9001.49  [also labelled BATT1_CURRENT_PROT]
B1_VOLTAGE: U$9001.47  [also labelled BATT1_VOLTAGE_PROT]
CAN_H_1: U$9001.79
CAN_H_2: U$9001.41
CAN_L_1: U$9001.77
CAN_L_2: U$9001.39
FMU-CAP1-PROT: R12.8 U$9001.50
FMU-CAP2-PROT: R12.7 U$9001.52
FMU-CAP3-PROT: R12.6 U$9001.54
FMU-SWCLK: U$9001.2
FMU-SWDIO: U$9001.1
FMU_CH1: R9.4
FMU_CH1-PROT: R9.5 U$9001.80
FMU_CH2: R9.3
FMU_CH2-PROT: R9.6 U$9001.78
FMU_CH3: R9.2
FMU_CH3-PROT: R9.7 U$9001.76
FMU_CH4: R9.1
FMU_CH4-PROT: R9.8 U$9001.74
FMU_CH5: R10.4
FMU_CH5-PROT: R10.5 U$9001.72
FMU_CH6: R10.3
FMU_CH6-PROT: R10.6 U$9001.70
FMU_CH7: R10.2
FMU_CH7-PROT: R10.7 U$9001.68
FMU_CH8: R10.1
FMU_CH8-PROT: R10.8 U$9001.66
FMU_RESET: U$9001.53
GPIO_PPM_IN: R23.1 R47.2 U22.4(Y)
GPIO_SPI5_MISO: U$9001.67
GPIO_SPI5_MOSI: U$9001.51
GPIO_SPI5_SCK: U$9001.73
I2C1_SCL: R29.1 R44.1
I2C1_SDA: R30.1 R37.1
I2C2_SCL: R15.1 R57.1
I2C2_SDA: R16.1 R28.1
I2C3_SCL: R58.1 R61.1
I2C3_SDA: R59.1 R60.1
I2C4_SCL: R24.1 R43.1
I2C4_SDA: R25.1 R26.1
I2C_2_SCL: R57.2 U$9001.6
I2C_2_SDA: R28.2 U$9001.4
I2C_3_SCL: R61.2 U$9001.10
I2C_3_SDA: R60.2 U$9001.8
I2C_4_SCL: R26.2 U$9001.5
I2C_4_SDA: R43.2 U$9001.3
I2C_SCL1_GPS: R44.2 U$9001.37
I2C_SDA1_GPS: R37.2 U$9001.35
IO-USART1_TX: R12.5 U$9001.46
nPOWER_IN_A: U$9001.55
nPOWER_IN_B: U$9001.57
nPOWER_IN_C: U$9001.59
NRST: U$9001.7
nSAFETY_SWITCH_LED: U$9001.28
nSPI5_RESET_EXTERNAL1: U$9001.60
nVDD_5V_HIPOWER_OC: U$9001.45
nVDD_5V_PERIPH_EN: U$9001.27
nVDD_5V_PERIPH_OC: U$9001.43
OTG_N: U$9001.33
OTG_P: U$9001.31
RC_IN: R17.1 R23.2 U22.1(IN1) U22.3(IN0)
RC_IN_PORT: R17.2 U$9001.62
RSSI_IN: R65.2 U$9001.26
RSSI_IN_CHANNEL: R65.1
SAFETY: R27.2 U$9001.17
SAFETY_SWITCH_IN: R27.1 R77.2
SBUSINV: R48.2 U22.6(IN2)
SCALED_V5_CH_IN: R35.2 U$9001.75
SPI5_CS1_EX1: U$9001.48
SPI5_CS2_EX1: U$9001.11
SPI5_CS3_EX1: U$9001.19
TIM5_SPARE_4: U$9001.56
UART4_RX: R21.2
UART4_RX_I2C2: R21.7 U$9001.16
UART4_TX: R21.3
UART4_TX_I2C2: R21.6 U$9001.18
UART7_RX: R38.1
UART7_RX_DEBUG: R38.2 U$9001.69
UART7_TX: R39.1
UART7_TX_DEBUG: R39.2 U$9001.71
UART8_RX: R19.1
UART8_RX_PORT: R19.8 U$9001.12
UART8_TX: R19.2
UART8_TX_PORT: R19.7 U$9001.14
USART1_GPS1_RX: R19.6 U$9001.20
USART1_GPS1_TX: R19.5 U$9001.22
USART1_RX_GPS: R19.3
USART1_TX_GPS: R19.4
USART2_CTS: R11.4
USART2_CTS_PORT: R11.5 U$9001.44
USART2_RTS: R11.3
USART2_RTS_PORT: R11.6 U$9001.42
USART2_RX: R11.1
USART2_RX_PORT: R11.8 U$9001.38
USART2_TX: R11.2
USART2_TX_PORT: R11.7 U$9001.40
USART3_CTS: R20.2
USART3_CTS_PORT: R20.7 U$9001.32
USART3_RTS: R20.1
USART3_RTS_PORT: R20.8 U$9001.30
USART3_RX: R20.3
USART3_RX_PORT: R20.6 U$9001.34
USART3_TX: R20.4
USART3_TX_PORT: R20.5 U$9001.36
USART6_RX: R47.1
USART6_TX: R12.4
VBUS: U$9001.29
VDD_3V3_SENSORS_EN: R62.1

Not connected (* = marked no-connect by the designer): R21 1 8

### Notes on the sheet
- RC_INPUT is for any of PPM/SBUS/SPEKTRUM
- Labels drawn without touching a wire or pin: ADC=10, UART4=GPS2  ?

### Library data of the parts
R9-R12 R19-R21 = 0402-8R-4R
R15 R16 R24 R25 R29 R30 R58 R59 = 0402R10K: 0402R10K 1%
R17 R23 R26-R28 R34-R39 R43 R44 R47 R57 R60-R62 R65 R77 = 0402R100R: 0402R100R 1%
R48 = Res2: Resistor; Published: 8-Jun-2000; LatestRevisionDate: 17-Jul-2002; LatestRevisionNote: Re-released for DXP Platform.; PackageReference: AXIAL-0.4; Publisher: Altium Limited; PackageDescription: Axial Device, Thru-Hole; 2 Leads; 0.4 in Pin Spacing; Value: 1K
U22 = 74LVC1G57
U$9001 = CON-DF17-80F

## Nets that join several sheets
GND: 01_V5_SYS (61 pins), 02_V5_IO1 (C20.2 C21.2 R70.2), 10_CAN_BUS (6 pins), IMU_CON (I2C1.1 I2C1.10 IMU.1 IMU.30), 11_5V_RAIL_ADC (6 pins), 12_B_TO_B (6 pins)
GPIO_HW_VER_DRIVE: 02_V5_IO1 (U1.N7), 11_5V_RAIL_ADC (R67.1)
HW_REV_DRIVE: 02_V5_IO1 (U1.E13), 11_5V_RAIL_ADC (R69.1)
MCU_3V3: 01_V5_SYS (30 pins), 02_V5_IO1 (R31.2 R32.2), 11_5V_RAIL_ADC (R66.2 R68.2), 12_B_TO_B (6 pins)
VDD_5V_IN: 01_V5_SYS (C46.1 U2.1), 10_CAN_BUS (U20.3 U21.3), IMU_CON (I2C1.2 I2C1.9), 12_B_TO_B (U$9001.61 U$9001.63 U$9001.65)
VDD_5V_IN_IMU: IMU_CON (IMU.2 IMU.3), 12_B_TO_B (U$9001.9)
ADC1_SPARE_1: 02_V5_IO1 (U1.N5), 11_5V_RAIL_ADC (R73.1 R74.2)
ADC1_SPARE_1_CHANNEL: 11_5V_RAIL_ADC (R73.2), 12_B_TO_B (U$9001.64)
ADC1_SPARE_2: 02_V5_IO1 (U1.N4), 11_5V_RAIL_ADC (R71.1 R72.2)
ADC1_SPARE_2_CHANNEL: 11_5V_RAIL_ADC (R71.2), 12_B_TO_B (U$9001.58)
ADC_3V3_SENSORS: 02_V5_IO1 (U1.M3), 12_B_TO_B (R34.1)
ADC_SCALED_V5_CH: 02_V5_IO1 (U1.M2), 12_B_TO_B (R35.1 R36.2)
ALARM_CHANNEL: 02_V5_IO1 (U1.B2), 12_B_TO_B (R21.4)
AUX_BATT_CURRENT_SENS: 02_V5_IO1 (U1.R2), 11_5V_RAIL_ADC (R63.1), 12_B_TO_B (U$9001.25)
AUX_BATT_VOLTAGE_SENS: 02_V5_IO1 (U1.P2), 11_5V_RAIL_ADC (R64.1), 12_B_TO_B (U$9001.23)
AUX_CH1: 02_V5_IO1 (U1.P4), 12_B_TO_B (R12.1)
AUX_CH2: 02_V5_IO1 (U1.A10), 12_B_TO_B (R12.2)
AUX_CH3: 02_V5_IO1 (U1.R13), 12_B_TO_B (R12.3)
B1_CURRENT: 02_V5_IO1 (U1.N2), 11_5V_RAIL_ADC (R13.1), 12_B_TO_B (U$9001.49)
B1_VOLTAGE: 02_V5_IO1 (U1.N3), 11_5V_RAIL_ADC (R14.1), 12_B_TO_B (U$9001.47)
CAN_H_1: 10_CAN_BUS (R45.1 U20.7), 12_B_TO_B (U$9001.79)
CAN_H_2: 10_CAN_BUS (R46.1 U21.7), 12_B_TO_B (U$9001.41)
CAN_L_1: 10_CAN_BUS (R45.2 U20.6), 12_B_TO_B (U$9001.77)
CAN_L_2: 10_CAN_BUS (R46.2 U21.6), 12_B_TO_B (U$9001.39)
FMU-SWCLK: 02_V5_IO1 (U1.A14), 12_B_TO_B (U$9001.2)
FMU-SWDIO: 02_V5_IO1 (U1.A15), 12_B_TO_B (U$9001.1)
FMU_CH1: 02_V5_IO1 (U1.P11), 12_B_TO_B (R9.4)
FMU_CH2: 02_V5_IO1 (U1.D15), 12_B_TO_B (R9.3)
FMU_CH3: 02_V5_IO1 (U1.P10), 12_B_TO_B (R9.2)
FMU_CH4: 02_V5_IO1 (U1.P9), 12_B_TO_B (R9.1)
FMU_CH5: 02_V5_IO1 (U1.M15), 12_B_TO_B (R10.4)
FMU_CH6: 02_V5_IO1 (U1.M14), 12_B_TO_B (R10.3)
FMU_CH7: 02_V5_IO1 (U1.M11), 12_B_TO_B (R10.2)
FMU_CH8: 02_V5_IO1 (U1.M13), 12_B_TO_B (R10.1)
FMU_RESET: 01_V5_SYS (U5.3), 12_B_TO_B (U$9001.53)
GPIO_CAN1_RX: 02_V5_IO1 (U1.D3), 10_CAN_BUS (U20.4)
GPIO_CAN1_TX: 02_V5_IO1 (U1.E12), 10_CAN_BUS (U20.1)
GPIO_CAN2_RX: 02_V5_IO1 (U1.P12), 10_CAN_BUS (U21.4)
GPIO_CAN2_TX: 02_V5_IO1 (U1.P13), 10_CAN_BUS (U21.1)
GPIO_PPM_IN: 02_V5_IO1 (U1.C4), 12_B_TO_B (R23.1 R47.2 U22.4)
GPIO_SPI5_MISO: 02_V5_IO1 (U1.L3), IMU_CON (IMU.18), 12_B_TO_B (U$9001.67)
GPIO_SPI5_MOSI: 02_V5_IO1 (U1.L2), IMU_CON (IMU.19), 12_B_TO_B (U$9001.51)
GPIO_SPI5_SCK: 02_V5_IO1 (U1.K1), IMU_CON (IMU.17), 12_B_TO_B (U$9001.73)
HEATER: 02_V5_IO1 (U1.R3), IMU_CON (IMU.26)
HW_REV_SENSE_CH: 02_V5_IO1 (U1.M5), 11_5V_RAIL_ADC (R68.1 R69.2)
HW_VER_SENSE_CH: 02_V5_IO1 (U1.M4), 11_5V_RAIL_ADC (R66.1 R67.2)
I2C1_SCL: 02_V5_IO1 (U1.A5), IMU_CON (I2C1.3), 12_B_TO_B (R29.1 R44.1)
I2C1_SDA: 02_V5_IO1 (U1.B4), IMU_CON (I2C1.4), 12_B_TO_B (R30.1 R37.1)
I2C2_SCL: 02_V5_IO1 (U1.H3), 12_B_TO_B (R15.1 R57.1)
I2C2_SDA: 02_V5_IO1 (U1.E2), 12_B_TO_B (R16.1 R28.1)
I2C3_SCL: 02_V5_IO1 (U1.N12), 12_B_TO_B (R58.1 R61.1)
I2C3_SDA: 02_V5_IO1 (U1.M12), 12_B_TO_B (R59.1 R60.1)
I2C4_SCL: 02_V5_IO1 (U1.R7), 12_B_TO_B (R24.1 R43.1)
I2C4_SDA: 02_V5_IO1 (U1.P7), 12_B_TO_B (R25.1 R26.1)
nPOWER_IN_A: 02_V5_IO1 (U1.M7), 12_B_TO_B (U$9001.55)
nPOWER_IN_B: 02_V5_IO1 (U1.L15), 12_B_TO_B (U$9001.57)
nPOWER_IN_C: 02_V5_IO1 (U1.K15), 12_B_TO_B (U$9001.59)
NRST: 01_V5_SYS (R5.1 U1.J1 U5.1), 12_B_TO_B (U$9001.7)
nSAFETY_SWITCH_LED: 02_V5_IO1 (U1.R10), 12_B_TO_B (U$9001.28)
nSPI5_RESET_EXTERNAL1: 02_V5_IO1 (U1.R12), 12_B_TO_B (U$9001.60)
nVDD_5V_HIPOWER_OC: 02_V5_IO1 (R31.1 U1.N6), 12_B_TO_B (U$9001.45)
nVDD_5V_PERIPH_EN: 02_V5_IO1 (U1.K14), 12_B_TO_B (U$9001.27)
nVDD_5V_PERIPH_OC: 02_V5_IO1 (R32.1 U1.R11), 12_B_TO_B (U$9001.43)
RSSI_IN_CHANNEL: 02_V5_IO1 (U1.R5), 12_B_TO_B (R65.1)
SAFETY_SWITCH_IN: 02_V5_IO1 (U1.R9), 12_B_TO_B (R27.1 R77.2)
SPI1_CS1_ICM20689: 02_V5_IO1 (U1.H2), IMU_CON (IMU.22)
SPI1_CS2_ICM20602: 02_V5_IO1 (U1.J2), IMU_CON (IMU.29)
SPI1_CS3_BMI055_GYRO: 02_V5_IO1 (U1.J3), IMU_CON (IMU.20)
SPI1_CS4_BMI055_ACC: 02_V5_IO1 (U1.B10), IMU_CON (IMU.21)
SPI1_DRDY1_ICM20689: 02_V5_IO1 (U1.A9), IMU_CON (IMU.27)
SPI1_DRDY2_BMI055_GYRO: 02_V5_IO1 (U1.R14), IMU_CON (IMU.5)
SPI1_DRDY3_BMI055_ACC: 02_V5_IO1 (U1.R15), IMU_CON (IMU.9)
SPI1_DRDY4_ICM20602: 02_V5_IO1 (U1.P5), IMU_CON (IMU.28)
SPI1_DRDY5_BMI055_GYRO: 02_V5_IO1 (U1.D1), IMU_CON (IMU.10)
SPI1_DRDY6_BMI055_ACC: 02_V5_IO1 (U1.N15), IMU_CON (IMU.11)
SPI1_MISO: 02_V5_IO1 (U1.P3), IMU_CON (IMU.6)
SPI1_MOSI: 02_V5_IO1 (U1.A11), IMU_CON (IMU.7)
SPI1_SCK: 02_V5_IO1 (U1.B9), IMU_CON (IMU.4)
SPI4_CS1_MS5611: 02_V5_IO1 (U1.L1), IMU_CON (IMU.8)
SPI4_CS2: 02_V5_IO1 (U1.R6), IMU_CON (IMU.16)
SPI4_MISO: 02_V5_IO1 (U1.N11), IMU_CON (IMU.23)
SPI4_MOSI: 02_V5_IO1 (U1.B3), IMU_CON (IMU.24)
SPI4_SCK: 02_V5_IO1 (U1.A2), IMU_CON (IMU.25)
SPI5_CS1_EX1: 02_V5_IO1 (U1.D4), IMU_CON (IMU.12), 12_B_TO_B (U$9001.48)
SPI5_CS2_EX1: 02_V5_IO1 (U1.E3), IMU_CON (IMU.13), 12_B_TO_B (U$9001.11)
SPI5_CS3_EX1: 02_V5_IO1 (U1.E4), IMU_CON (IMU.14), 12_B_TO_B (U$9001.19)
TIM5_SPARE_4: 02_V5_IO1 (U1.E14), 12_B_TO_B (U$9001.56)
UART4_RX: 02_V5_IO1 (U1.B12), 12_B_TO_B (R21.2)
UART4_TX: 02_V5_IO1 (U1.C12), 12_B_TO_B (R21.3)
UART7_RX: 02_V5_IO1 (U1.K2), 12_B_TO_B (R38.1)
UART7_TX: 02_V5_IO1 (U1.P8), 12_B_TO_B (R39.1)
UART8_RX: 02_V5_IO1 (U1.A4), 12_B_TO_B (R19.1)
UART8_TX: 02_V5_IO1 (U1.A3), 12_B_TO_B (R19.2)
UI_LED_BLUE: 02_V5_IO1 (U1.K12), IMU_CON (I2C1.8)
UI_LED_GREEN: 02_V5_IO1 (U1.L12), IMU_CON (I2C1.7)
UI_LED_RED: 02_V5_IO1 (U1.L13), IMU_CON (I2C1.6)
USART1_RX_GPS: 02_V5_IO1 (U1.B5), 12_B_TO_B (R19.3)
USART1_TX_GPS: 02_V5_IO1 (U1.B6), 12_B_TO_B (R19.4)
USART2_CTS: 02_V5_IO1 (U1.D11), 12_B_TO_B (R11.4)
USART2_RTS: 02_V5_IO1 (U1.D10), 12_B_TO_B (R11.3)
USART2_RX: 02_V5_IO1 (U1.B11), 12_B_TO_B (R11.1)
USART2_TX: 02_V5_IO1 (U1.C11), 12_B_TO_B (R11.2)
USART3_CTS: 02_V5_IO1 (U1.N14), 12_B_TO_B (R20.2)
USART3_RTS: 02_V5_IO1 (U1.N13), 12_B_TO_B (R20.1)
USART3_RX: 02_V5_IO1 (U1.P14), 12_B_TO_B (R20.3)
USART3_TX: 02_V5_IO1 (U1.P15), 12_B_TO_B (R20.4)
USART6_RX: 02_V5_IO1 (U1.C10), 12_B_TO_B (R47.1)
USART6_TX: 02_V5_IO1 (U1.A7), 12_B_TO_B (R12.4)
VDD_3V3_SENSORS_EN: 02_V5_IO1 (U1.A1), IMU_CON (IMU.15), 12_B_TO_B (R62.1)